# Altium schematic sheet CON_RS232DCE_DB9_TH.SchDoc: RS232-DCE DB9
size A4; Organization: Altium Limited.; Address1: Level 3, 12a Rodborough Rd; Address2: Frenchs Forest 2086; Address3: NSW; Address4: AUSTRALIA; DocumentNumber: 18; SheetNumber: 19; SheetTotal: 77
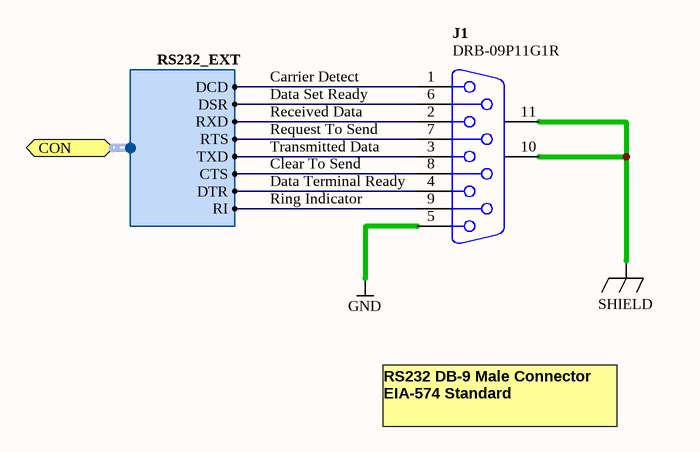
[diagram p0: CON_RS232DCE_DB9_TH.SchDoc]

## Parts
J1  DRB-09P11G1R  [DB9_MALE]

## Ports
CON (harness RS232_EXT)

## Harnesses
RS232_EXT: DCD, RXD, TXD, DTR, DSR, RTS, CTS, RI

## Nets
GND: J1.5
SHIELD: J1.10(MH1) J1.11(MH2)
NetJ1_1: J1.1 ; port CON.DCD
NetJ1_2: J1.2 ; port CON.RXD
NetJ1_3: J1.3 ; port CON.TXD
NetJ1_4: J1.4 ; port CON.DTR
NetJ1_6: J1.6 ; port CON.DSR
NetJ1_7: J1.7 ; port CON.RTS
NetJ1_8: J1.8 ; port CON.CTS
NetJ1_9: J1.9 ; port CON.RI

## Notes on the sheet
- (near J1) Transmitted Data
- Received Data
- Data Set Ready
- (near J1) Request To Send
- Clear To Send
- Carrier Detect
- (near J1) Data Terminal Ready
- Ring Indicator
- RS232 DB-9 Male Connector
  EIA-574 Standard
- Sheet Title
- Project Title
- Size:
- Date:
- A4
- Assy:
- Time:
- Revision:
- Sheet
- of
- File:

## Library data of the parts
J1 = D-300-0120: Connector, DB9 R/A Through-hole Male; Connector type: Header; Max Current: 3A; Mounting Technology: Through-Hole; Pin Count: 9; Status: Unreleased; Category: Connector